# EasyEDA schematic 1-Schematic_EMWAVER_ONE.json
TITLE: Sheet_1; REV: 1.0; Date: 2022-12-25; Sheet: 1/1; Drawn By: maarnotto; Company: Your Company
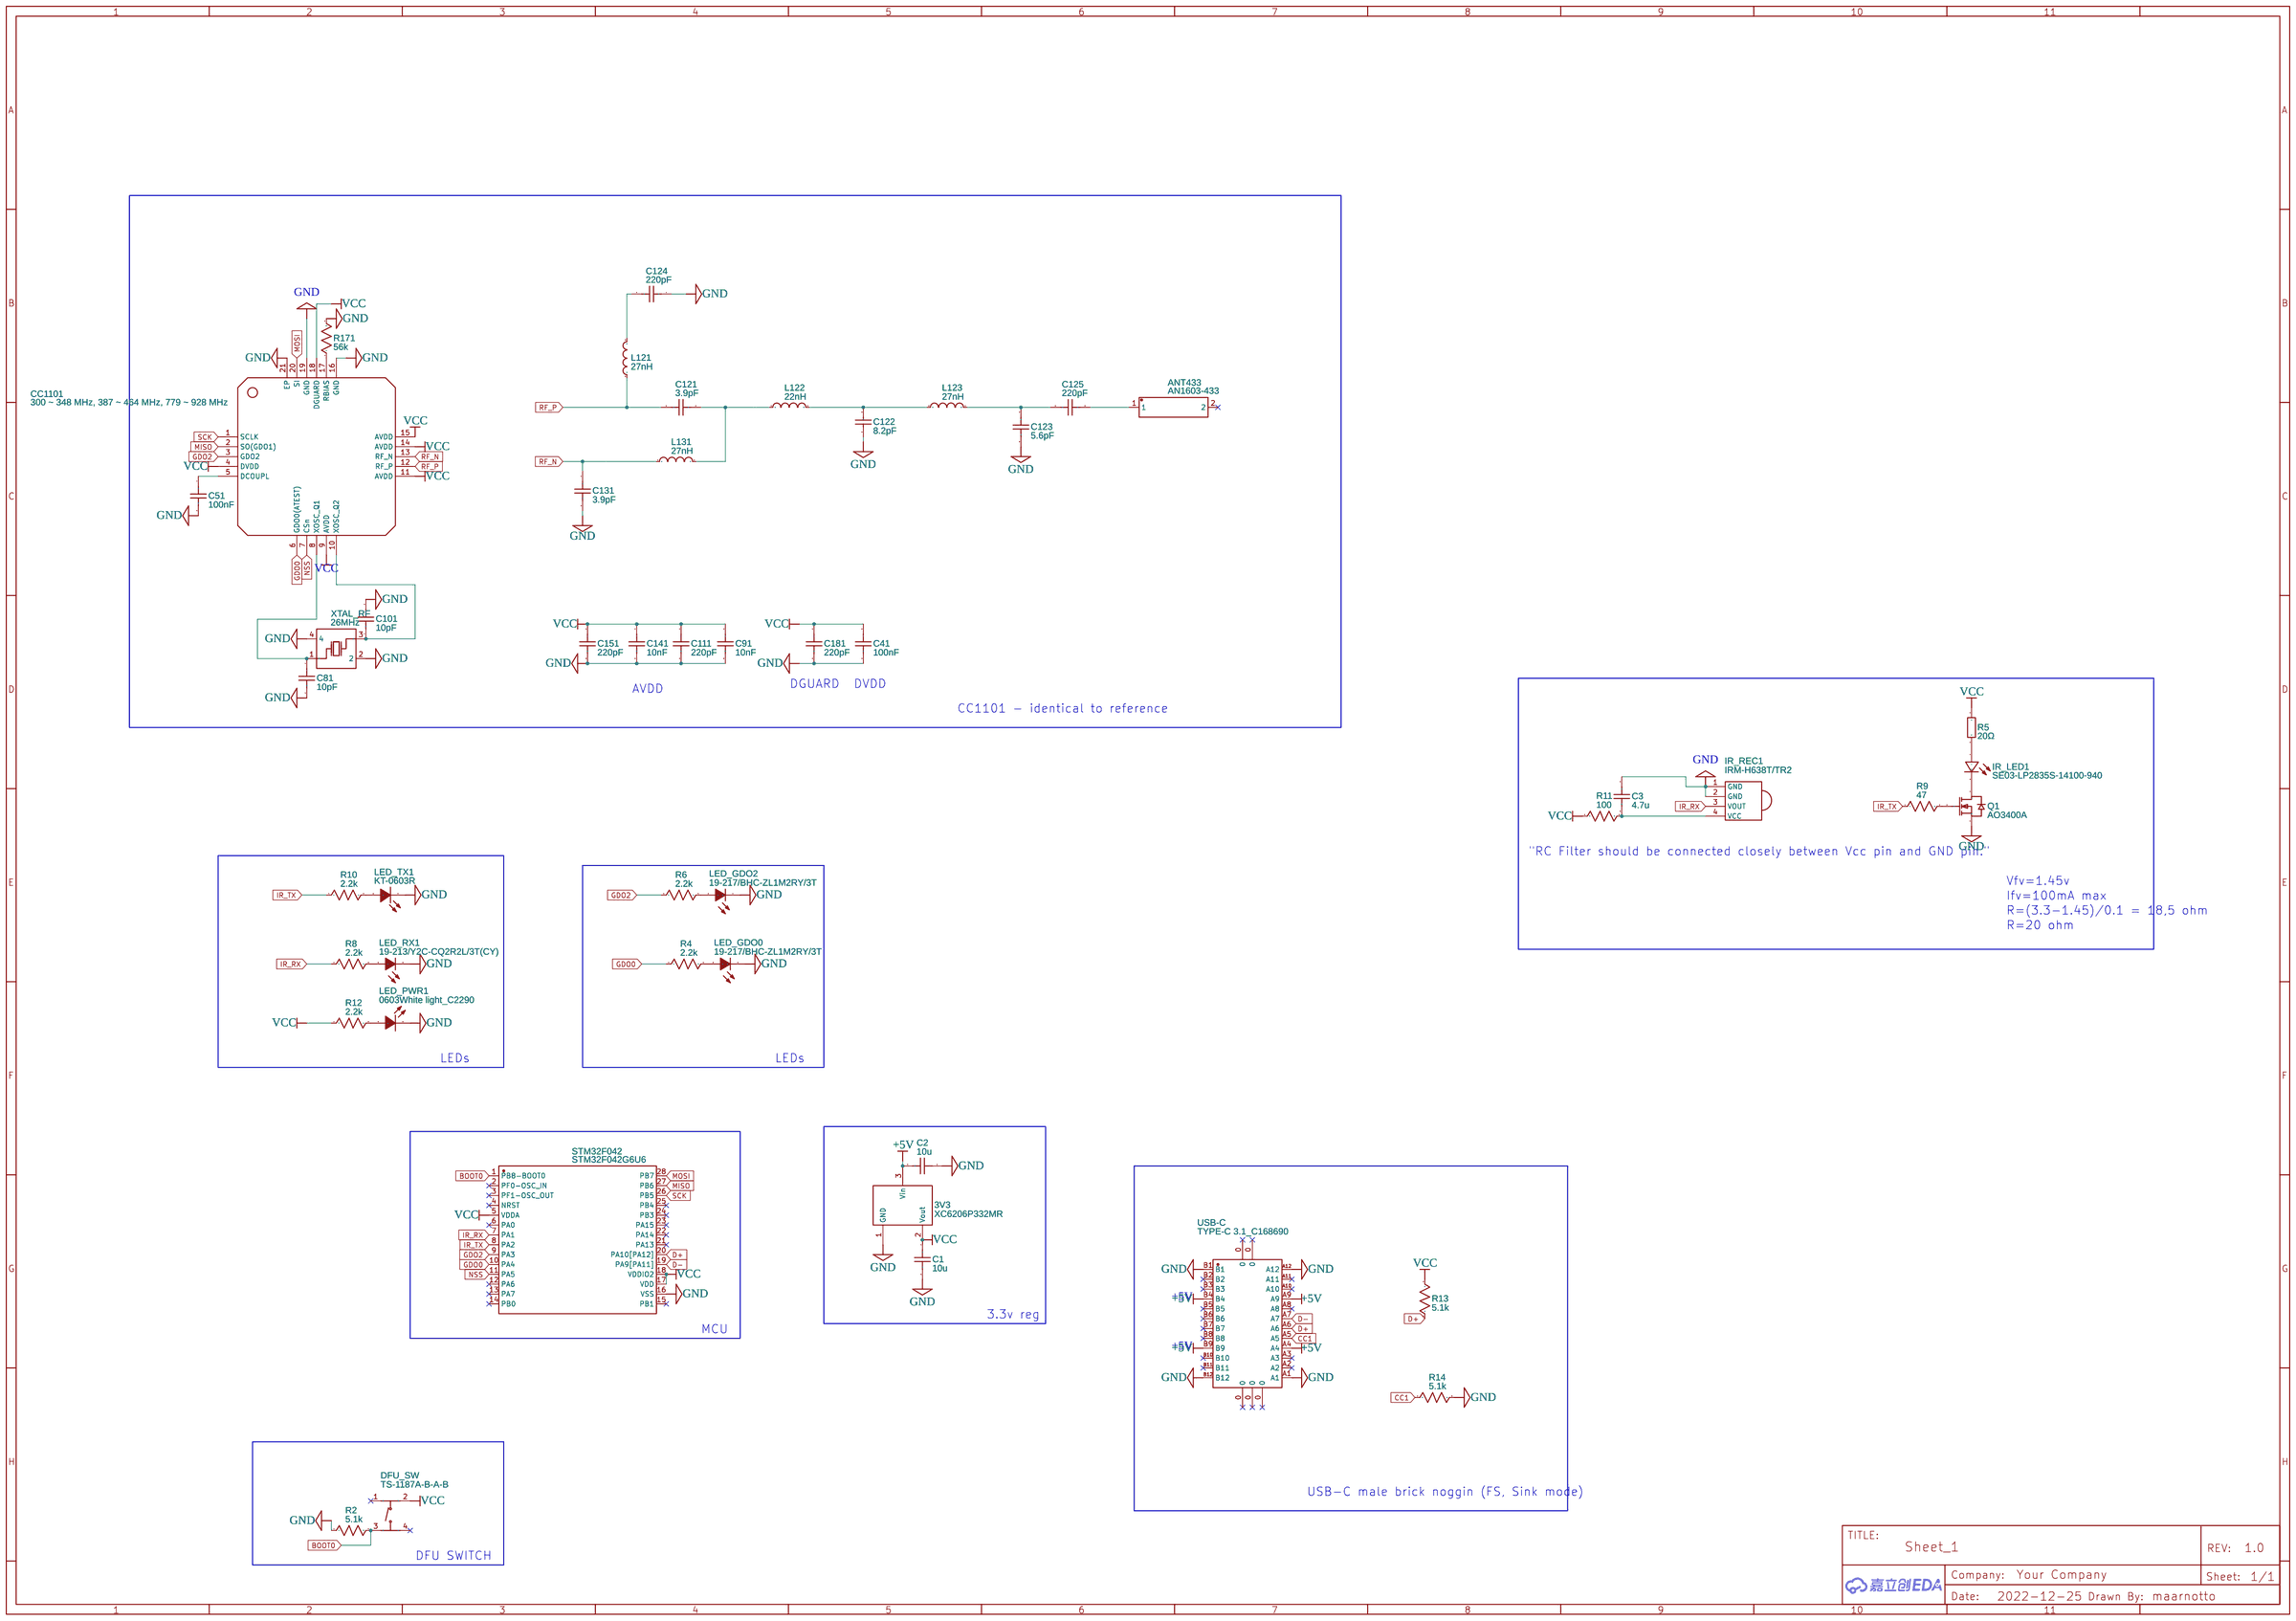
[diagram p0: schematic sheet]

## Parts
3V3  XC6206P332MR  [SOT-23-3_L2.9-W1.6-P1.90-LS2.8-BR]
ANT433  AN1603-433  [ANT-SMD_L16.0-W3.1]
C1  10u  [C0603]
C2  10u  [C0603]
C3  4.7u  [C0603]
C41  100nF  [C0402]
C51  100nF  [C0402]
C81  10pF  [C0402]
C91  10nF  [C0402]
C101  10pF  [C0402]
C111  220pF  [C0402]
C121  3.9pF  [C0402]
C122  8.2pF  [C0402]
C123  5.6pF  [C0402]
C124  220pF  [C0402]
C125  220pF  [C0402]
C131  3.9pF  [C0402]
C141  10nF  [C0402]
C151  220pF  [C0402]
C181  220pF  [C0402]
CC1101  300 ~ 348 MHz, 387 ~ 464 MHz, 779 ~ 928 MHz  [QFN-20_L4.0-W4.0-P0.5-TL-EP]
DFU_SW  TS-1187A-B-A-B  [SW-SMD_4P-L5.1-W5.1-P3.70-LS6.5-TL-2]
IR_LED1  SE03-LP2835S-14100-940  [SENSOR-SMD_L3.5-W2.8-FD]
IR_REC1  IRM-H638T/TR2  [SENSOR-SMD_IRM-H638T-TR2-TL]
L121  27nH  [L0402]
L122  22nH  [L0402]
L123  27nH  [L0402]
L131  27nH  [L0402]
LED_GDO0  19-217/BHC-ZL1M2RY/3T  [LED0603-RD]
LED_GDO2  19-217/BHC-ZL1M2RY/3T  [LED0603-RD]
LED_PWR1  0603White light_C2290  [LED0603-R-RD_WHITE]
LED_RX1  19-213/Y2C-CQ2R2L/3T(CY)  [LED0603-RD-YELLOW]
LED_TX1  KT-0603R  [LED0603-RD]
Q1  AO3400A  [SOT-23-3_L2.9-W1.6-P1.90-LS2.8-BR]
R2  5.1k  [R0603]
R4  2.2k  [R0603]
R5  20Ω  [R1206]
R6  2.2k  [R0603]
R8  2.2k  [R0603]
R9  47  [R0603]
R10  2.2k  [R0603]
R11  100  [R0603]
R12  2.2k  [R0603]
R13  5.1k  [R0603]
R14  5.1k  [R0603]
R171  56k  [R0402]
STM32F042  STM32F042G6U6  [UFQFPN-28_L4.0-W4.0-P0.50-BL]
USB-C  TYPE-C 3.1_C168690  [USB-C-SMD_TYPE-C-USB-3]
XTAL_RF  26MHz  [CRYSTAL-SMD_4P-L3.2-W2.5-BL]

## Library data of the parts
3V3 = XC6206P332MR: Supplier: LCSC; Manufacturer: TOREX(特瑞仕); Supplier Part: C5446; JLCPCB Part Class: Basic Part
ANT433 = AN1603-433: Supplier: LCSC; Supplier Part: C122806; Manufacturer: rainsun(霖昱微); Contributor: LCSC; JLCPCB Part Class: Extended Part
C1-C3 = C_0603_US: Contributor: LCEDA_Lib
C41 C51 C81 C91 C101 C111 C121 C123-C125 C131 C141 C151 C181 = C_0402_US: Contributor: LCEDA_Lib
C122 = 0402CG8R2C500NT: Supplier: LCSC; Manufacturer: FH(风华); Supplier Part: C1579; JLCPCB Part Class: Extended Part
CC1101 = CC1101RGPR: Supplier: LCSC; Manufacturer: TI(德州仪器); Supplier Part: C29953; JLCPCB Part Class: Extended Part
DFU_SW = TS-1187A-B-A-B: Supplier: LCSC; Supplier Part: C318884; Manufacturer: XKB Connectivity(中国星坤); Contributor: LCSC; JLCPCB Part Class: Basic Part
IR_LED1 = SE03-LP2835S-14100-940: Contributor: lcsc; Supplier: LCSC; Supplier Part: C5205247; Manufacturer: XSSY(旭晟); JLCPCB Part Class: Extended Part
IR_REC1 = IRM-H638T/TR2: Supplier: LCSC; Manufacturer: EVERLIGHT(亿光); Supplier Part: C91447; JLCPCB Part Class: Extended Part
L121-L123 L131 = L0402_US: Supplier Part: C14033; Contributor: LCEDA_Lib
LED_GDO0 LED_GDO2 = 19-217/BHC-ZL1M2RY/3T: Supplier: LCSC; Manufacturer: EVERLIGHT(亿光); Supplier Part: C72041; JLCPCB Part Class: Basic Part
LED_PWR1 = 0603White light_C2290: Supplier: LCSC; Manufacturer: null; Manufacturer Part: KT-0603白灯; Supplier Part: C2290; JLCPCB Part Class: Basic Part
LED_RX1 = 19-213/Y2C-CQ2R2L/3T(CY): Supplier: LCSC; Manufacturer: EVERLIGHT(亿光); Supplier Part: C72038; JLCPCB Part Class: Basic Part
LED_TX1 = KT-0603R: Supplier: LCSC; Manufacturer: KENTO; Supplier Part: C2286; JLCPCB Part Class: Basic Part
Q1 = AO3400A: Supplier: LCSC; Manufacturer: AOS; Supplier Part: C20917; JLCPCB Part Class: Basic Part
R2 R4 R6 R8-R14 = R_0603_US: Contributor: LCEDA_Lib
R5 = 1206W4F200JT5E: Supplier: LCSC; Manufacturer: UNI-ROYAL(厚声); Supplier Part: C17955; JLCPCB Part Class: Basic Part
R171 = R_0402_US: Contributor: LCEDA_Lib
STM32F042 = STM32F042G6U6: Contributor: LCSC; Supplier: LCSC; Supplier Part: C961597; Manufacturer: ST(意法半导体); JLCPCB Part Class: Extended Part
USB-C = TYPE-C 3.1_C168690: Contributor: 立创EDA官方封装库; Supplier: LCSC; Supplier Part: C168690; Manufacturer: 精拓金; Manufacturer Part: 918-118A2021Y40000; JLCPCB Part Class: Extended Part
XTAL_RF = 3S26000333: Supplier: LCSC; Supplier Part: C431163; Manufacturer: YL(惠伦晶体); Contributor: LCSC; JLCPCB Part Class: Extended Part

## Nets
+5V: 3V3.3(Vin) C2.2 USB-C.A4 USB-C.A9 USB-C.B4 USB-C.B9
GND: 3V3.1(GND) C1.2 C2.1 C3.1 C41.2 C51.2 C81.2 C91.2 C101.2 C111.2 C122.1 C123.2 C124.1 C131.2 C141.2 C151.2 C181.2 CC1101.16(GND) CC1101.19(GND) CC1101.21(EP) IR_REC1.1(GND) IR_REC1.2(GND) LED_GDO0.1(C) LED_GDO2.1(C) LED_PWR1.2(K) LED_RX1.1(C) LED_TX1.1(K) Q1.2(S) R2.1 R14.2 R171.2 STM32F042.16(VSS) USB-C.A1 USB-C.A12 USB-C.B1 USB-C.B12 XTAL_RF.2 XTAL_RF.4
VCC: 3V3.2(Vout) C1.1 C41.1 C91.1 C111.1 C141.1 C151.1 C181.1 CC1101.4(DVDD) CC1101.9(AVDD) CC1101.11(AVDD) CC1101.14(AVDD) CC1101.15(AVDD) CC1101.18(DGUARD) DFU_SW.2(B) R5.1 R11.1 R12.1 R13.1 STM32F042.5(VDDA) STM32F042.17(VDD) STM32F042.18(VDDIO2)
BOOT0: DFU_SW.3(C) R2.2 STM32F042.1(PB8-BOOT0)
CC1: R14.1 USB-C.A5
D+: R13.2 STM32F042.20(PA10[PA12]) USB-C.A6
D-: STM32F042.19(PA9[PA11]) USB-C.A7
GDO0: CC1101.6(GDO0(ATEST)) R4.1 STM32F042.10(PA4)
GDO2: CC1101.3(GDO2) R6.1 STM32F042.9(PA3)
IR_RX: IR_REC1.3(VOUT) R8.1 STM32F042.7(PA1)
IR_TX: R9.1 R10.1 STM32F042.8(PA2)
MISO: CC1101.2(SO(GDO1)) STM32F042.27(PB6)
MOSI: CC1101.20(SI) STM32F042.28(PB7)
NSS: CC1101.7(CSn) STM32F042.11(PA5)
RF_N: C131.1 CC1101.13(RF_N) L131.1
RF_P: C121.2 CC1101.12(RF_P) L121.1
SCK: CC1101.1(SCLK) STM32F042.26(PB5)
Net-(ANT433-1): ANT433.1 C125.1
Net-(C3-2): C3.2 IR_REC1.4(VCC) R11.2
Net-(C51-1): C51.1 CC1101.5(DCOUPL)
Net-(C81-1): C81.1 CC1101.8(XOSC_Q1) XTAL_RF.1(OSC1)
Net-(C101-1): C101.1 CC1101.10(XOSC_Q2) XTAL_RF.3(OSC2)
Net-(C121-1): C121.1 L122.1 L131.2
Net-(C122-2): C122.2 L122.2 L123.1
Net-(C123-1): C123.1 C125.2 L123.2
Net-(C124-2): C124.2 L121.2
Net-(CC1101-17): CC1101.17(RBIAS) R171.1
Net-(IR_LED1-1): IR_LED1.1(A) R5.2
Net-(IR_LED1-2): IR_LED1.2(C) Q1.3(D)
Net-(LED_GDO0-2): LED_GDO0.2(A) R4.2
Net-(LED_GDO2-2): LED_GDO2.2(A) R6.2
Net-(LED_PWR1-1): LED_PWR1.1(A) R12.2
Net-(LED_RX1-2): LED_RX1.2(A) R8.2
Net-(LED_TX1-2): LED_TX1.2(A) R10.2
Net-(Q1-1): Q1.1(G) R9.2

Not connected (* = marked no-connect by the designer): ANT433 2*; DFU_SW 1(A)* 4(D)*; STM32F042 2(PF0-OSC_IN)* 3(PF1-OSC_OUT)* 4(NRST)* 6(PA0)* 12(PA6)* 13(PA7)* 14(PB0)* 15(PB1)* 21(PA13)* 22(PA14)* 23(PA15)* 24(PB3)* 25(PB4)*; USB-C 0* A2* A3* A8* A10* A11* B2* B3* B5* B6* B7* B8* B10* B11*

## Notes on the sheet
- DGUARD
- DVDD
- AVDD
- CC1101 - identical to reference
- "RC Filter should be connected closely between Vcc pin and GND pin."
- Vfv=1.45v
- Ifv=100mA max
- R=(3.3-1.45)/0.1 = 18,5 ohm
- R=20 ohm
- LEDs
- LEDs
- +5V
- 3.3v reg
- MCU
- +5V
- USB-C male brick noggin (FS, Sink mode)
- DFU SWITCH
